# Altium schematic sheet TrafficLight_ABCDEF.SchDoc
size A4; DocumentNumber: 1; SheetNumber: 1; SheetTotal: 1
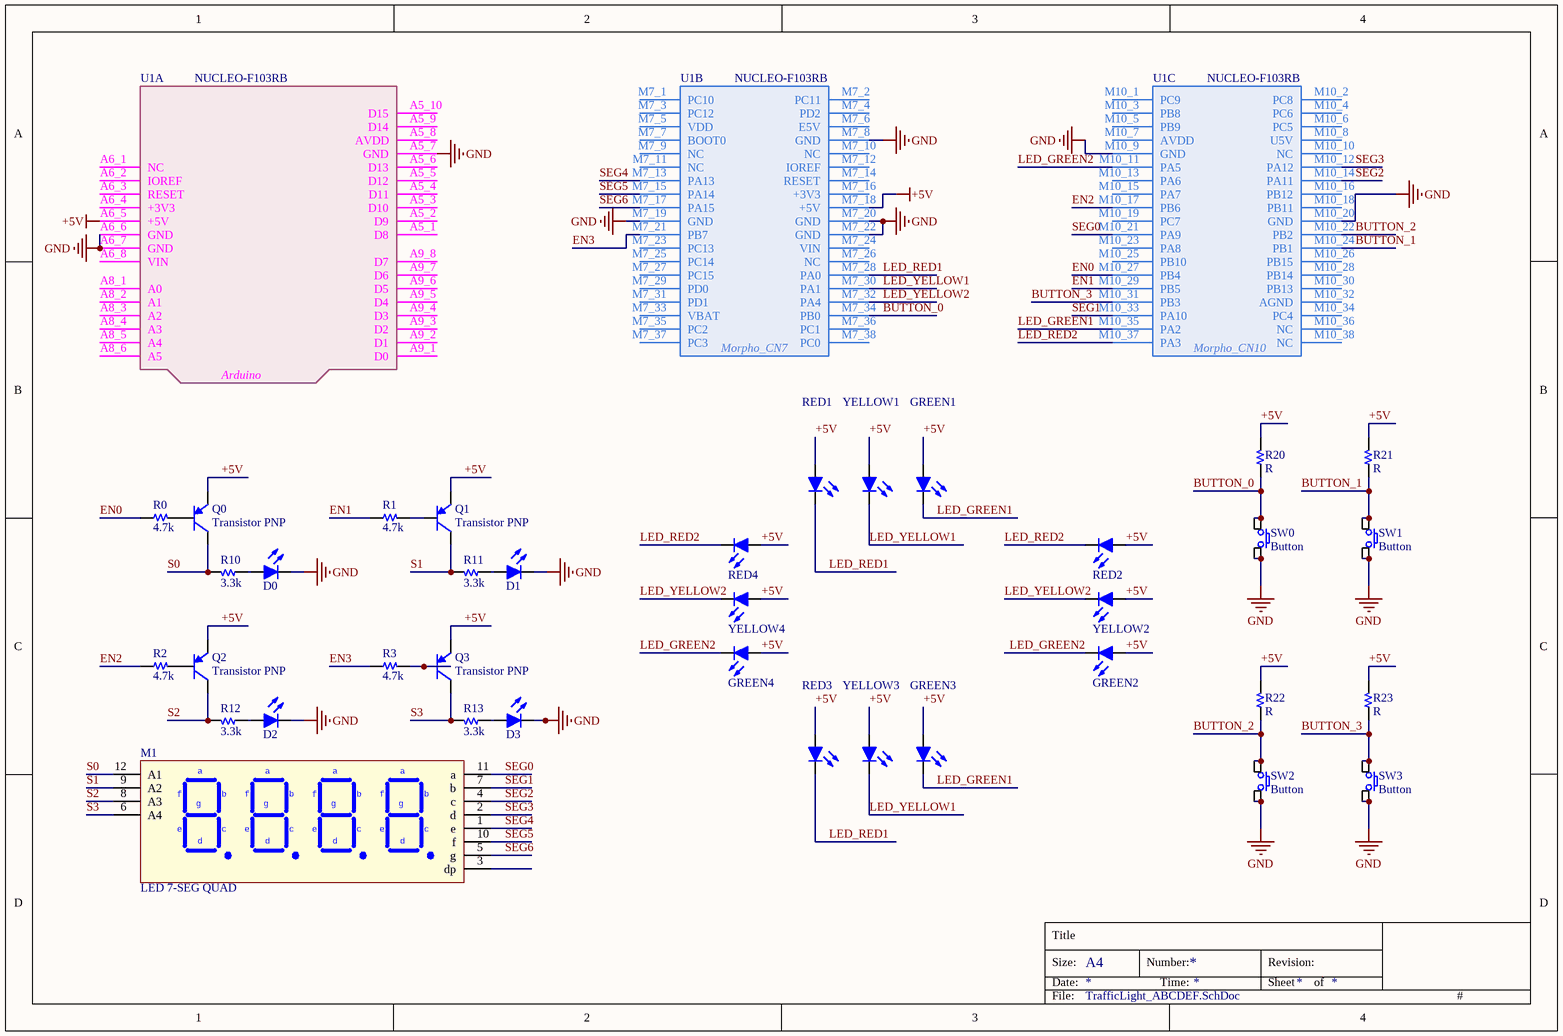
[diagram p0: TrafficLight_ABCDEF.SchDoc]

## Parts
D0  Led  [Led 0603 - red]  (value not drawn)
D1  Led  [Led 0603 - red]  (value not drawn)
D2  Led  [Led 0603 - red]  (value not drawn)
D3  Led  [Led 0603 - red]  (value not drawn)
GREEN1  Led  [LED 5MM - GREEN]  (value not drawn)
GREEN2  Led  [LED 5MM - GREEN]  (value not drawn)
GREEN3  Led  [LED 5MM - GREEN]  (value not drawn)
GREEN4  Led  [LED 5MM - GREEN]  (value not drawn)
M1  LED 7-SEG QUAD  [LED/7SEG/0.56/QUAD]
Q0  Transistor PNP  [SOT-23]
Q1  Transistor PNP  [SOT-23]
Q2  Transistor PNP  [SOT-23]
Q3  Transistor PNP  [SOT-23]
R0  4.7k  [R 0805]
R1  4.7k  [R 0805]
R2  4.7k  [R 0805]
R3  4.7k  [R 0805]
R10  3.3k  [R 0805]
R11  3.3k  [R 0805]
R12  3.3k  [R 0805]
R13  3.3k  [R 0805]
R20  R  [R 0805]
R21  R  [R 0805]
R22  R  [R 0805]
R23  R  [R 0805]
RED1  Led  [LED 3MM - red]  (value not drawn)
RED2  Led  [LED 3MM - red]  (value not drawn)
RED3  Led  [LED 3MM - red]  (value not drawn)
RED4  Led  [LED 3MM - red]  (value not drawn)
SW0  Button  [SW/4/12mm]
SW1  Button  [SW/4/12mm]
SW2  Button  [SW/4/12mm]
SW3  Button  [SW/4/12mm]
U1  NUCLEO-F103RB  [NUCLEO]  (parts A,B,C of 3)
YELLOW1  Led  [LED 3MM - yellow]  (value not drawn)
YELLOW2  Led  [LED 3MM - yellow]  (value not drawn)
YELLOW3  Led  [LED 3MM - yellow]  (value not drawn)
YELLOW4  Led  [LED 3MM - yellow]  (value not drawn)

## Nets
+5V: GREEN1.1(A) GREEN2.1(A) GREEN3.1(A) GREEN4.1(A) Q0.2(E) Q1.2(E) Q2.2(E) Q3.2(E) R20.2 R21.2 R22.2 R23.2 RED1.1(A) RED2.1(A) RED3.1(A) RED4.1(A) U1.A6_5(+5V) U1.M7_18(+5V) YELLOW1.1(A) YELLOW2.1(A) YELLOW3.1(A) YELLOW4.1(A)
GND: D0.2(K) D1.2(K) D2.2(K) D3.2(K) SW0.3 SW0.4 SW1.3 SW1.4 SW2.3 SW2.4 SW3.3 SW3.4 U1.A5_7(GND) U1.A6_6(GND) U1.A6_7(GND) U1.M7_8(GND) U1.M7_19(GND) U1.M7_20(GND) U1.M7_22(GND) U1.M10_9(GND) U1.M10_20(GND)
BUTTON_0: R20.1 SW0.1 SW0.2 U1.M7_34(PB0)
BUTTON_1: R21.1 SW1.1 SW1.2 U1.M10_24(PB1)
BUTTON_2: R22.1 SW2.1 SW2.2 U1.M10_22(PB2)
BUTTON_3: R23.1 SW3.1 SW3.2 U1.M10_31(PB3)
EN0: R0.1 U1.M10_27(PB4)
EN1: R1.1 U1.M10_29(PB5)
EN2: R2.1 U1.M10_17(PB6)
EN3: R3.1 U1.M7_21(PB7)
LED_GREEN1: GREEN1.2(K) GREEN3.2(K) U1.M10_35(PA2)
LED_GREEN2: GREEN2.2(K) GREEN4.2(K) U1.M10_11(PA5)
LED_RED1: RED1.2(K) RED3.2(K) U1.M7_28(PA0)
LED_RED2: RED2.2(K) RED4.2(K) U1.M10_37(PA3)
LED_YELLOW1: U1.M7_30(PA1) YELLOW1.2(K) YELLOW3.2(K)
LED_YELLOW2: U1.M7_32(PA4) YELLOW2.2(K) YELLOW4.2(K)
S0: M1.12(A1) Q0.3(C) R10.2
S1: M1.9(A2) Q1.3(C) R11.2
S2: M1.8(A3) Q2.3(C) R12.2
S3: M1.6(A4) Q3.3(C) R13.2
SEG0: M1.11(a) U1.M10_21(PA9)
SEG1: M1.7(b) U1.M10_33(PA10)
SEG2: M1.4(c) U1.M10_14(PA11)
SEG3: M1.2(d) U1.M10_12(PA12)
SEG4: M1.1(e) U1.M7_13(PA13)
SEG5: M1.10(f) U1.M7_15(PA14)
SEG6: M1.5(g) U1.M7_17(PA15)
NetD0_1: D0.1(A) R10.1
NetD1_1: D1.1(A) R11.1
NetD2_1: D2.1(A) R12.1
NetD3_1: D3.1(A) R13.1
NetQ0_1: Q0.1(B) R0.2
NetQ1_1: Q1.1(B) R1.2
NetQ2_1: Q2.1(B) R2.2
NetQ3_1: Q3.1(B) R3.2

Not connected (* = marked no-connect by the designer): M1 3(dp); U1 A5_1(D8) A5_2(D9) A5_3(D10) A5_4(D11) A5_5(D12) A5_6(D13) A5_8(AVDD) A5_9(D14) A5_10(D15) A6_1(NC) A6_2(IOREF) A6_3(RESET) A6_4(+3V3) A6_8(VIN) A8_1(A0) A8_2(A1) A8_3(A2) A8_4(A3) A8_5(A4) A8_6(A5) A9_1(D0) A9_2(D1) A9_3(D2) A9_4(D3) A9_5(D4) A9_6(D5) A9_7(D6) A9_8(D7) M7_1(PC10) M7_2(PC11) M7_3(PC12) M7_4(PD2) M7_5(VDD) M7_6(E5V) M7_7(BOOT0) M7_9(NC) M7_10(NC) M7_11(NC) M7_12(IOREF) M7_14(RESET) M7_16(+3V3) M7_23(PC13) M7_24(VIN) M7_25(PC14) M7_26(NC) M7_27(PC15) M7_29(PD0) M7_31(PD1) M7_33(VBAT) M7_35(PC2) M7_36(PC1) M7_37(PC3) M7_38(PC0) M10_1(PC9) M10_2(PC8) M10_3(PB8) M10_4(PC6) M10_5(PB9) M10_6(PC5) M10_7(AVDD) M10_8(U5V) M10_10(NC) M10_13(PA6) M10_15(PA7) M10_16(PB12) M10_18(PB11) M10_19(PC7) M10_23(PA8) M10_25(PB10) M10_26(PB15) M10_28(PB14) M10_30(PB13) M10_32(AGND) M10_34(PC4) M10_36(NC) M10_38(NC)

## Notes on the sheet
- Title
- Size:
- Date:
- A4
- Number:
- Time:
- *
- Revision:
- Sheet
- of
- File:
- #
- (in symbol NUCLEO-F103RB, part A) Arduino
- (in symbol NUCLEO-F103RB, part B) Morpho_CN7
- (in symbol NUCLEO-F103RB, part C) Morpho_CN10

## Library data of the parts
D0-D3 GREEN1-GREEN4 RED1-RED4 YELLOW1-YELLOW4 = Led: Typical LED
M1 = LED 7-SEG QUAD: LED 7-SEG 0.56 QUAD RED
Q0-Q3 = Transistor PNP: PNP Bipolar Transistor
R0-R3 R10-R13 R20-R23 = Resistor
SW0-SW3 = SW SPST 4-pin: Tact switch 4-pin
U1 = NUCLEO-F103RB: STM32F103RB, mbed-Enabled Development Nucleo-64 STM32F1 ARM® Cortex®-M3 MCU 32-Bit Embedded Evaluation Board; Manufacturer: STMicroelectronics; Manufacturer Product Number: NUCLEO-F103RB; BRAND: STMicroelectronics; PART NO: NUCLEO-F103RB; STOCK CODE: 497-14362-ND; SUPPLIER: digi-key; TYPE: EVAL BRD